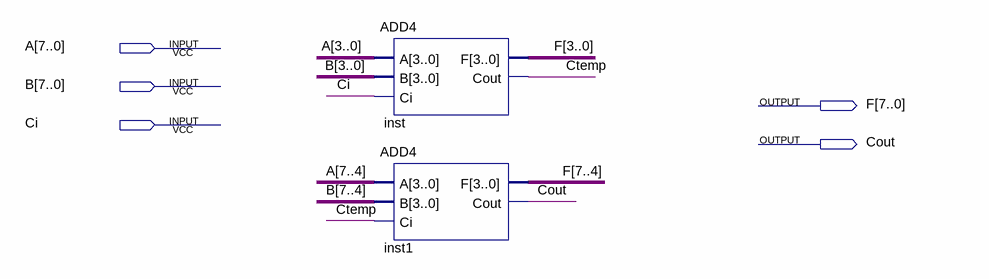
[diagram p0: schematic sheet]
// Quartus schematic ADD8.bdf as structural Verilog: 2 symbols, 5 pins
module ADD8 (
  input  [7:0] A,
  input  [7:0] B,
  input  Ci,
  output [7:0] F,
  output Cout
);

  wire Ctemp;

  ADD4 inst (.A(A[3:0]), .B(B[3:0]), .Ci(Ci), .F(F[3:0]), .Cout(Ctemp));
  ADD4 inst1 (.A(A[7:4]), .B(B[7:4]), .Ci(Ctemp), .F(F[7:4]), .Cout(Cout));
endmodule
